# Altium project connectedPCB.PrjPcb
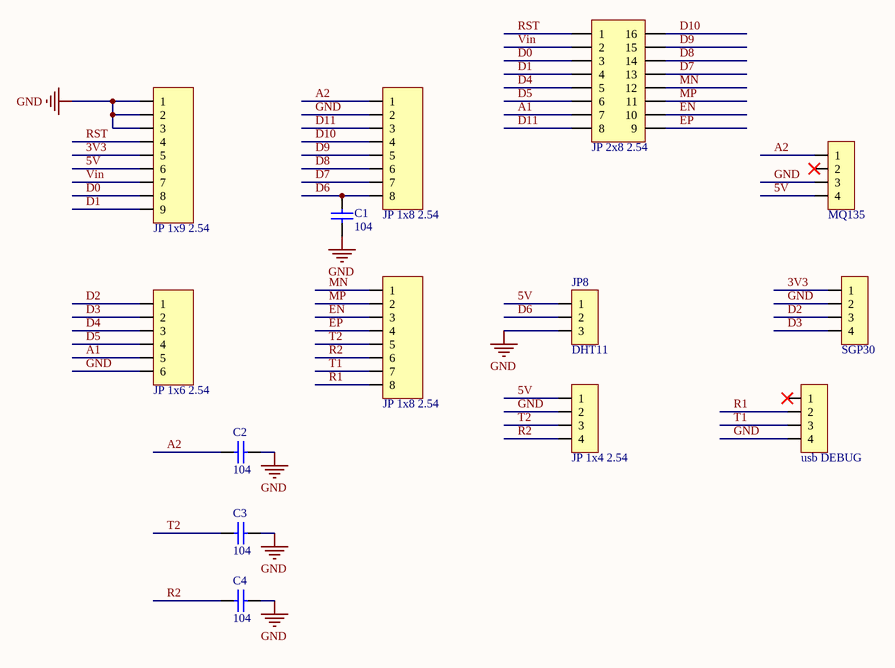
[diagram p0: Sheet2.SchDoc]
1 sheet, 14 parts. Net scope: global (net labels, ports and power ports of the same name join across sheets).
Board file: PCB1.PcbDoc

## Sheet Sheet2.SchDoc
size A; SheetNumber: 1; SheetTotal: 1

### Parts
C1  104  [tu 0805]
C2  104  [tu 0805]
C3  104  [tu 0805]
C4  104  [tu 0805]
JP1  JP 2x8 2.54  [JP 2x8 DT]
JP2  JP 1x9 2.54  [JP 1x9 DT]
JP3  JP 1x8 2.54  [JP 1x8 DT]
JP4  MQ135  [JP 1x4 DT]
JP5  JP 1x8 2.54  [JP 1x8 DT]
JP6  SGP30  [JP 1x4 DT]
JP7  JP 1x6 2.54  [JP 1x6 DT]
JP8  DHT11  [JP 1x3 DT]
JP9  JP 1x4 2.54  [JP 1x4 DT]
JP10  usb DEBUG  [JP 1x4 DT]

### Nets
GND: C1.2 C2.1 C3.1 C4.1 JP2.1 JP2.2 JP2.3 JP3.2 JP4.3 JP6.2 JP7.6 JP8.3 JP9.2 JP10.4
3V3: JP2.5 JP6.1
5V: JP2.6 JP4.4 JP8.1 JP9.1
A1: JP1.7 JP7.5
A2: C2.2 JP3.1 JP4.1
D0: JP1.3 JP2.8
D1: JP1.4 JP2.9
D2: JP6.3 JP7.1
D3: JP6.4 JP7.2
D4: JP1.5 JP7.3
D5: JP1.6 JP7.4
D6: C1.1 JP3.8 JP8.2
D7: JP1.13 JP3.7
D8: JP1.14 JP3.6
D9: JP1.15 JP3.5
D10: JP1.16 JP3.4
D11: JP1.8 JP3.3
EN: JP1.10 JP5.3
EP: JP1.9 JP5.4
MN: JP1.12 JP5.1
MP: JP1.11 JP5.2
R1: JP5.8 JP10.2
R2: C4.2 JP5.6 JP9.4
RST: JP1.1 JP2.4
T1: JP5.7 JP10.3
T2: C3.2 JP5.5 JP9.3
Vin: JP1.2 JP2.7

Not connected (* = marked no-connect by the designer): JP4 2*; JP10 1*

### Library data of the parts
C1-C4 = Tu 0805 104 50V 10%: Dán; Don_Vi: Con; So_Chan: 2; Ten_Linh_Kien: Tụ 0805 104-100nF 10% 50V; Ma_Hang: MH004551; Chung_Loai: Dán; Kieu_Chan: *
JP1 = JP 2x8 2.54 Duc Thang: Cắm; Ten_Linh_Kien: Jump Đôi Đực 2.54MM 2x40P Thẳng 11MM; Don_Vi: Con; Ma_Hang: MH002686; Ghi_Chu: *; Kieu_Chan: *; Chung_Loai: Cắm
JP2 = JP 1x9 2.54 Duc Thang: Cắm; Ten_Linh_Kien: Jump Đơn Đực 2.54MM 1x40P Thẳng 11MM; Don_Vi: Con; Ma_Hang: MH000903; Ghi_Chu: *; Kieu_Chan: *; Chung_Loai: Cắm
JP3 JP5 = JP 1x8 2.54 Duc Thang: Cắm; Ten_Linh_Kien: Jump Đơn Đực 2.54MM 1x40P Thẳng 11MM; Don_Vi: Con; Ma_Hang: MH000903; Ghi_Chu: *; Kieu_Chan: *; Chung_Loai: Cắm
JP4 JP6 JP9 JP10 = JP 1x4 2.54 Duc Thang: Cắm; Ten_Linh_Kien: Jump Đơn Đực 2.54MM 1x40P Thẳng 11MM; Don_Vi: Con; Ma_Hang: MH000903; Ghi_Chu: *; Kieu_Chan: *; Chung_Loai: Cắm
JP7 = JP 1x6 2.54 Duc Thang: Cắm; Ten_Linh_Kien: Jump Đơn Đực 2.54MM 1x40P Thẳng 11MM; Don_Vi: Con; Ma_Hang: MH000903; Ghi_Chu: *; Kieu_Chan: *; Chung_Loai: Cắm
JP8 = JP 1x3 2.54 Duc Thang_1: Cắm; Ten_Linh_Kien: Jump Đơn Đực 2.54MM 1x40P Thẳng 11MM; Don_Vi: Con; Ma_Hang: MH000903; Ghi_Chu: *; Kieu_Chan: *; Chung_Loai: Cắm